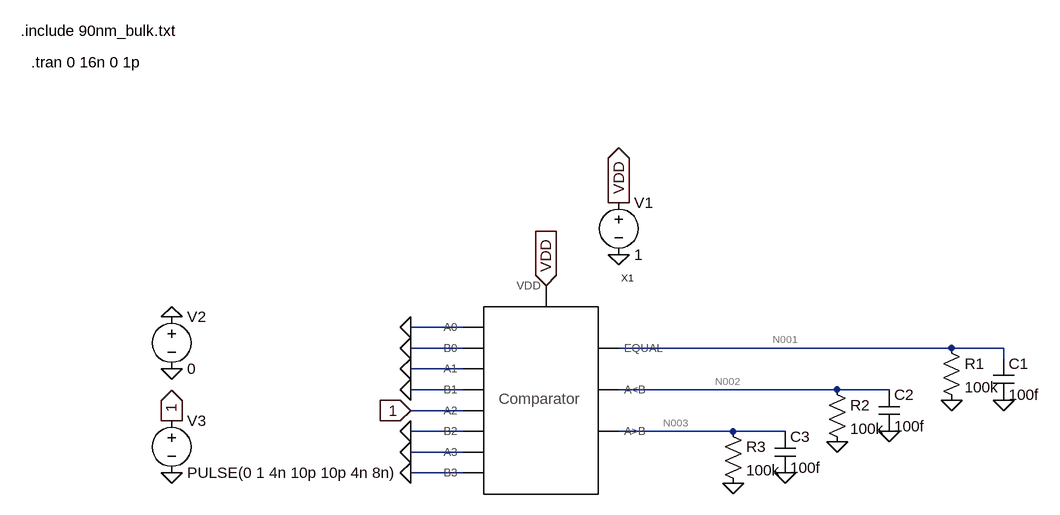
[diagram p0: schematic testComp.asc]
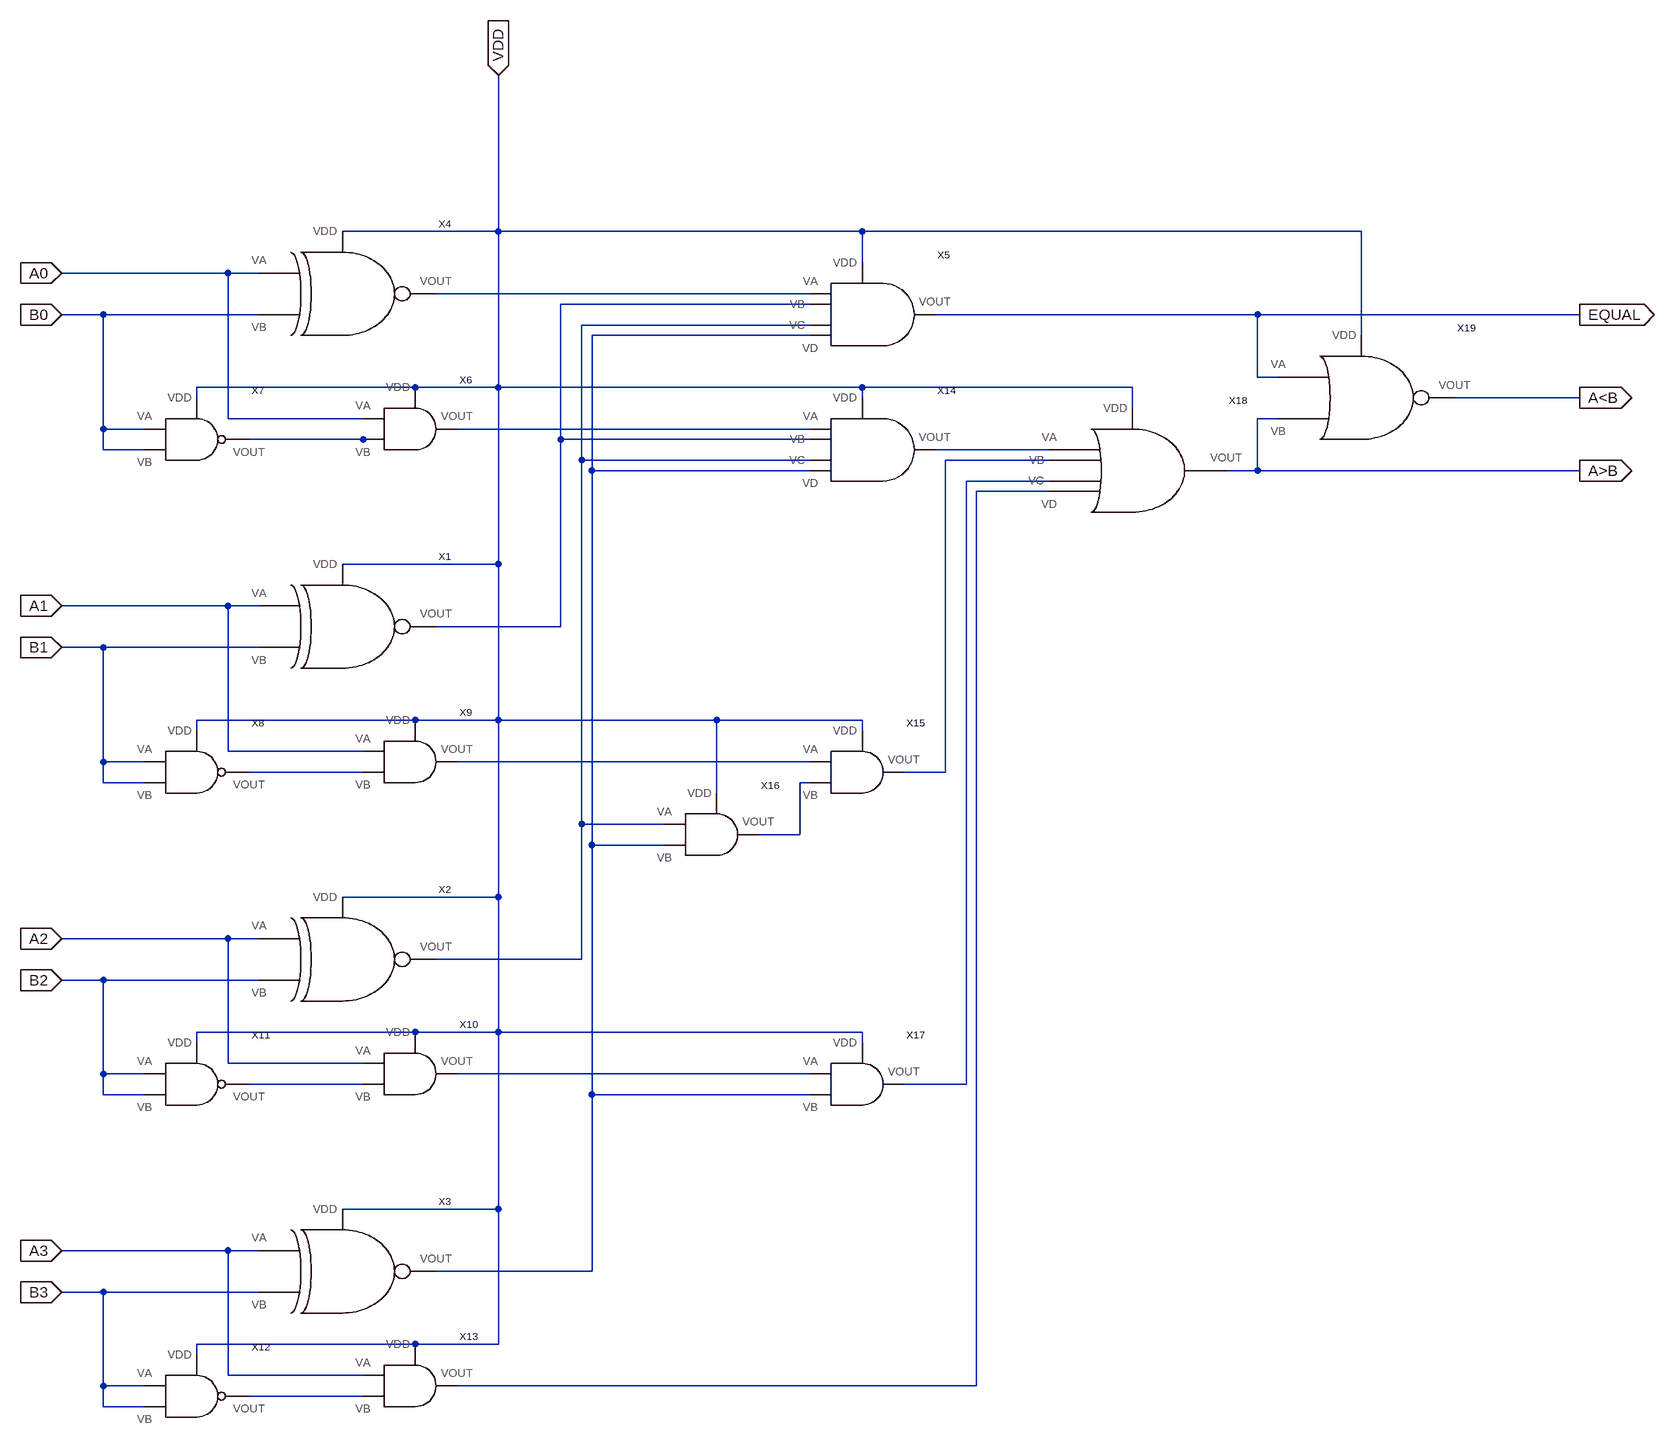
[diagram p1: sub-circuit comparator.asc]
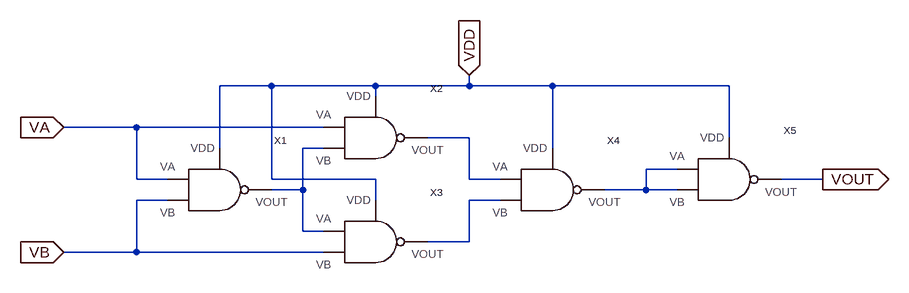
[diagram p2: sub-circuit xnor.asc]
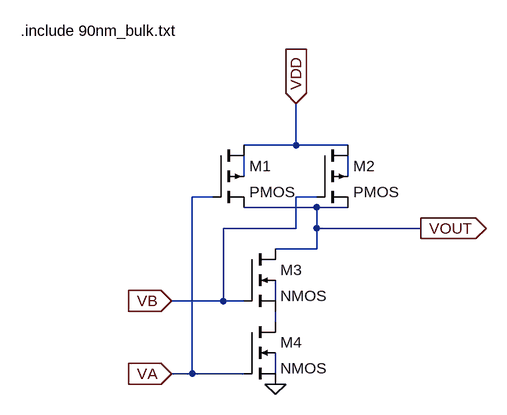
[diagram p3: sub-circuit nand.asc]
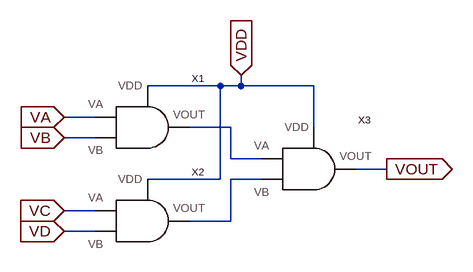
[diagram p4: sub-circuit and4.asc]
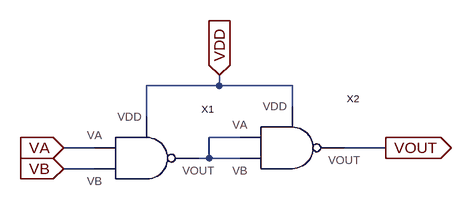
[diagram p5: sub-circuit and.asc]
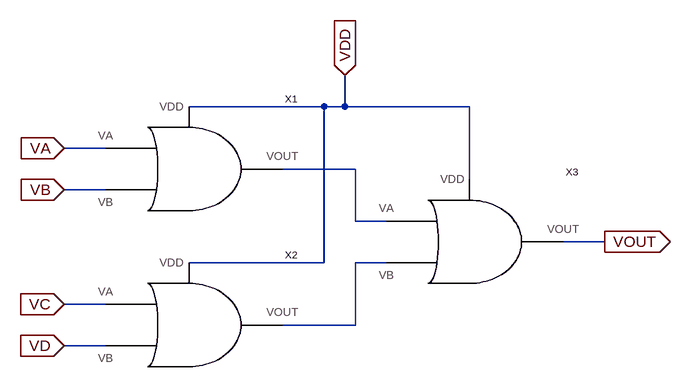
[diagram p6: sub-circuit or4.asc]
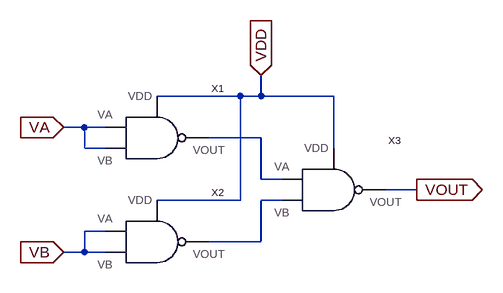
[diagram p7: sub-circuit or.asc]
testComp.asc, the LTspice schematic file:
Version 4
SHEET 1 1360 724
WIRE 112 80 32 80
WIRE 112 112 32 112
WIRE 864 112 352 112
WIRE 944 112 864 112
WIRE 944 128 944 112
WIRE 112 144 32 144
WIRE 112 176 32 176
WIRE 688 176 352 176
WIRE 768 176 688 176
WIRE 112 208 32 208
WIRE 112 240 32 240
WIRE 528 240 352 240
WIRE 608 240 528 240
WIRE 112 272 32 272
WIRE 112 304 32 304
FLAG 32 80 0
IOPIN 32 80 In
FLAG 32 112 0
IOPIN 32 112 In
FLAG 32 144 0
IOPIN 32 144 In
FLAG 32 176 0
IOPIN 32 176 In
FLAG 32 208 1
IOPIN 32 208 In
FLAG 32 240 0
IOPIN 32 240 In
FLAG 32 272 0
IOPIN 32 272 In
FLAG 32 304 0
IOPIN 32 304 In
FLAG 944 192 0
FLAG 768 240 0
FLAG 608 304 0
FLAG 864 192 0
FLAG 688 256 0
FLAG 528 320 0
FLAG 352 -32 0
FLAG 352 -112 VDD
IOPIN 352 -112 Out
FLAG -336 144 0
FLAG -336 64 0
IOPIN -336 64 Out
FLAG -336 304 0
FLAG -336 224 1
IOPIN -336 224 Out
FLAG 240 16 VDD
IOPIN 240 16 In
SYMBOL comparator 160 144 R0
SYMATTR InstName X1
SYMBOL cap 928 128 R0
SYMATTR InstName C1
SYMATTR Value 100f
SYMBOL cap 752 176 R0
SYMATTR InstName C2
SYMATTR Value 100f
SYMBOL cap 592 240 R0
SYMATTR InstName C3
SYMATTR Value 100f
SYMBOL res 848 96 R0
SYMATTR InstName R1
SYMATTR Value 100k
SYMBOL res 672 160 R0
SYMATTR InstName R2
SYMATTR Value 100k
SYMBOL res 512 224 R0
SYMATTR InstName R3
SYMATTR Value 100k
SYMBOL voltage 352 -128 R0
WINDOW 123 0 0 Left 0
WINDOW 39 0 0 Left 0
SYMATTR InstName V1
SYMATTR Value 1
SYMBOL voltage -336 48 R0
WINDOW 123 0 0 Left 0
WINDOW 39 0 0 Left 0
SYMATTR InstName V2
SYMATTR Value 0
SYMBOL voltage -336 208 R0
WINDOW 123 0 0 Left 0
WINDOW 39 0 0 Left 0
SYMATTR InstName V3
SYMATTR Value PULSE(0 1 4n 10p 10p 4n 8n)
TEXT -568 -376 Left 2 !.include 90nm_bulk.txt
TEXT -552 -328 Left 2 !.tran 0 16n 0 1p

comparator.asc, the sub-circuit schematic file:
Version 4
SHEET 1 2092 1544
WIRE 288 -304 288 -544
WIRE 288 -304 48 -304
WIRE 848 -304 288 -304
WIRE 1616 -304 848 -304
WIRE 848 -256 848 -304
WIRE -128 -240 -384 -240
WIRE -80 -240 -128 -240
WIRE 768 -208 192 -208
WIRE 768 -192 384 -192
WIRE -320 -176 -384 -176
WIRE -80 -176 -320 -176
WIRE 1456 -176 960 -176
WIRE 1952 -176 1456 -176
WIRE 768 -160 416 -160
WIRE 768 -144 432 -144
WIRE 1616 -144 1616 -304
WIRE 1456 -80 1456 -176
WIRE 1488 -80 1456 -80
WIRE 160 -64 -176 -64
WIRE 288 -64 288 -304
WIRE 288 -64 160 -64
WIRE 848 -64 288 -64
WIRE 1264 -64 848 -64
WIRE -176 -48 -176 -64
WIRE 848 -48 848 -64
WIRE 1952 -48 1760 -48
WIRE 1264 -32 1264 -64
WIRE -128 -16 -128 -240
WIRE 80 -16 -128 -16
WIRE 1488 -16 1456 -16
WIRE -320 0 -320 -176
WIRE -256 0 -320 0
WIRE 768 0 224 0
WIRE 80 16 -96 16
WIRE 96 16 80 16
WIRE 384 16 384 -192
WIRE 768 16 384 16
WIRE -320 32 -320 0
WIRE -256 32 -320 32
WIRE 1136 32 960 32
WIRE 416 48 416 -160
WIRE 768 48 416 48
WIRE 1136 48 976 48
WIRE 432 64 432 -144
WIRE 768 64 432 64
WIRE 1456 64 1456 -16
WIRE 1456 64 1408 64
WIRE 1952 64 1456 64
WIRE 1136 80 1008 80
WIRE 1136 96 1024 96
WIRE 288 208 288 -64
WIRE 288 208 48 208
WIRE -128 272 -384 272
WIRE -80 272 -128 272
WIRE 384 304 384 16
WIRE 384 304 192 304
WIRE -320 336 -384 336
WIRE -80 336 -320 336
WIRE 160 448 -176 448
WIRE 288 448 288 208
WIRE 288 448 160 448
WIRE 624 448 288 448
WIRE 848 448 624 448
WIRE -176 464 -176 448
WIRE 848 464 848 448
WIRE -128 496 -128 272
WIRE 80 496 -128 496
WIRE -320 512 -320 336
WIRE -256 512 -320 512
WIRE 768 512 224 512
WIRE 80 528 -96 528
WIRE 976 528 976 48
WIRE 976 528 912 528
WIRE -320 544 -320 512
WIRE -256 544 -320 544
WIRE 768 544 752 544
WIRE 624 560 624 448
WIRE 416 608 416 48
WIRE 544 608 416 608
WIRE 752 624 752 544
WIRE 752 624 688 624
WIRE 432 640 432 64
WIRE 544 640 432 640
WIRE 288 720 288 448
WIRE 288 720 48 720
WIRE -128 784 -384 784
WIRE -80 784 -128 784
WIRE 416 816 416 608
WIRE 416 816 192 816
WIRE -320 848 -384 848
WIRE -80 848 -320 848
WIRE 160 928 -176 928
WIRE 288 928 288 720
WIRE 288 928 160 928
WIRE 848 928 288 928
WIRE -176 944 -176 928
WIRE 848 944 848 928
WIRE -128 976 -128 784
WIRE 80 976 -128 976
WIRE -320 992 -320 848
WIRE -256 992 -320 992
WIRE 768 992 224 992
WIRE 80 1008 -96 1008
WIRE 1008 1008 1008 80
WIRE 1008 1008 912 1008
WIRE -320 1024 -320 992
WIRE -256 1024 -320 1024
WIRE 432 1024 432 640
WIRE 768 1024 432 1024
WIRE 288 1200 288 928
WIRE 288 1200 48 1200
WIRE -128 1264 -384 1264
WIRE -80 1264 -128 1264
WIRE 432 1296 432 1024
WIRE 432 1296 192 1296
WIRE -320 1328 -384 1328
WIRE -80 1328 -320 1328
WIRE 160 1408 -176 1408
WIRE 288 1408 288 1200
WIRE 288 1408 160 1408
WIRE -176 1424 -176 1408
WIRE -128 1456 -128 1264
WIRE 80 1456 -128 1456
WIRE -320 1472 -320 1328
WIRE -256 1472 -320 1472
WIRE 1024 1472 1024 96
WIRE 1024 1472 224 1472
WIRE 80 1488 -96 1488
WIRE -320 1504 -320 1472
WIRE -256 1504 -320 1504
FLAG -384 -240 A0
IOPIN -384 -240 In
FLAG -384 -176 B0
IOPIN -384 -176 In
FLAG -384 336 B1
IOPIN -384 336 In
FLAG -384 784 A2
IOPIN -384 784 In
FLAG -384 848 B2
IOPIN -384 848 In
FLAG -384 1264 A3
IOPIN -384 1264 In
FLAG -384 1328 B3
IOPIN -384 1328 In
FLAG -384 272 A1
IOPIN -384 272 In
FLAG 288 -544 VDD
IOPIN 288 -544 In
FLAG 1952 -176 EQUAL
IOPIN 1952 -176 Out
FLAG 1952 64 A>B
IOPIN 1952 64 Out
FLAG 1952 -48 A<B
IOPIN 1952 -48 Out
SYMBOL xnor 32 304 R0
SYMATTR InstName X1
SYMBOL xnor 32 816 R0
SYMATTR InstName X2
SYMBOL xnor 32 1296 R0
SYMATTR InstName X3
SYMBOL xnor 32 -208 R0
SYMATTR InstName X4
SYMBOL and4 816 -176 R0
SYMATTR InstName X5
SYMBOL and 128 0 R0
SYMATTR InstName X6
SYMBOL nand -192 0 R0
SYMATTR InstName X7
SYMBOL nand -192 512 R0
SYMATTR InstName X8
SYMBOL and 128 512 R0
SYMATTR InstName X9
SYMBOL and 128 992 R0
SYMATTR InstName X10
SYMBOL nand -192 992 R0
SYMATTR InstName X11
SYMBOL nand -192 1472 R0
SYMATTR InstName X12
SYMBOL and 128 1472 R0
SYMATTR InstName X13
SYMBOL and4 816 32 R0
SYMATTR InstName X14
SYMBOL and 816 528 R0
SYMATTR InstName X15
SYMBOL and 592 624 R0
SYMATTR InstName X16
SYMBOL and 816 1008 R0
SYMATTR InstName X17
SYMBOL or4 1248 64 R0
SYMATTR InstName X18
SYMBOL nor 1600 -48 R0
SYMATTR InstName X19

xnor.asc, the sub-circuit schematic file:
Version 4
SHEET 1 1196 680
WIRE 224 0 144 0
WIRE 384 0 224 0
WIRE 528 0 528 -16
WIRE 528 0 384 0
WIRE 656 0 528 0
WIRE 928 0 656 0
WIRE 384 16 384 0
WIRE 16 64 -96 64
WIRE 304 64 16 64
WIRE 528 80 464 80
WIRE 928 80 928 0
WIRE 144 96 144 0
WIRE 304 96 272 96
WIRE 656 96 656 0
WIRE 848 128 800 128
WIRE 16 144 16 64
WIRE 64 144 16 144
WIRE 224 144 224 0
WIRE 384 144 224 144
WIRE 528 144 528 80
WIRE 576 144 528 144
WIRE 1072 144 1008 144
WIRE 272 160 272 96
WIRE 272 160 224 160
WIRE 800 160 800 128
WIRE 800 160 736 160
WIRE 848 160 800 160
WIRE 64 176 16 176
WIRE 384 176 384 144
WIRE 576 176 528 176
WIRE 272 224 272 160
WIRE 304 224 272 224
WIRE 528 240 528 176
WIRE 528 240 464 240
WIRE 16 256 16 176
WIRE 16 256 -96 256
WIRE 304 256 16 256
FLAG 528 -16 VDD
IOPIN 528 -16 In
FLAG -96 64 VA
IOPIN -96 64 In
FLAG -96 256 VB
IOPIN -96 256 In
FLAG 1072 144 VOUT
IOPIN 1072 144 Out
SYMBOL nand 128 144 R0
SYMATTR InstName X1
SYMBOL nand 368 64 R0
SYMATTR InstName X2
SYMBOL nand 368 224 R0
SYMATTR InstName X3
SYMBOL nand 640 144 R0
SYMATTR InstName X4
SYMBOL nand 912 128 R0
SYMATTR InstName X5

nand.asc, the sub-circuit schematic file:
Version 4
SHEET 1 880 696
WIRE 496 272 496 208
WIRE 496 272 416 272
WIRE 576 272 496 272
WIRE 416 320 416 288
WIRE 576 320 576 288
WIRE 368 352 336 352
WIRE 528 352 496 352
WIRE 528 368 416 368
WIRE 576 368 528 368
WIRE 496 400 496 352
WIRE 496 400 384 400
WIRE 528 400 528 368
WIRE 688 400 528 400
WIRE 528 432 528 400
WIRE 528 432 464 432
WIRE 384 512 384 400
WIRE 384 512 304 512
WIRE 416 512 384 512
WIRE 464 512 464 480
WIRE 464 544 464 528
WIRE 336 624 336 352
WIRE 336 624 304 624
WIRE 416 624 336 624
WIRE 464 624 464 592
FLAG 304 624 VA
IOPIN 304 624 In
FLAG 304 512 VB
IOPIN 304 512 In
FLAG 496 208 VDD
IOPIN 496 208 In
FLAG 688 400 VOUT
IOPIN 688 400 Out
FLAG 464 640 0
SYMBOL nmos4 416 432 R0
SYMATTR InstName M3
SYMATTR Value2 l=90n w=200n
SYMBOL nmos4 416 544 R0
SYMATTR InstName M4
SYMATTR Value2 l=90n w=200n
SYMBOL pmos4 368 272 R0
SYMATTR InstName M1
SYMATTR Value2 l=90n w=400n
SYMBOL pmos4 528 272 R0
SYMATTR InstName M2
SYMATTR Value2 l=90n w=400n
TEXT 72 96 Left 2 !.include 90nm_bulk.txt

and4.asc, the sub-circuit schematic file:
Version 4
SHEET 1 880 680
WIRE 240 48 128 48
WIRE 272 48 272 32
WIRE 272 48 240 48
WIRE 384 48 272 48
WIRE 48 96 0 96
WIRE 256 112 192 112
WIRE 384 112 384 48
WIRE 48 128 0 128
WIRE 256 160 256 112
WIRE 304 160 256 160
WIRE 496 176 448 176
WIRE 240 192 240 48
WIRE 240 192 128 192
WIRE 304 192 256 192
WIRE 48 240 0 240
WIRE 256 256 256 192
WIRE 256 256 192 256
WIRE 48 272 0 272
FLAG 272 32 VDD
IOPIN 272 32 In
FLAG 496 176 VOUT
IOPIN 496 176 Out
FLAG 0 96 VA
IOPIN 0 96 In
FLAG 0 128 VB
IOPIN 0 128 In
FLAG 0 240 VC
IOPIN 0 240 In
FLAG 0 272 VD
IOPIN 0 272 In
SYMBOL and 96 112 R0
SYMATTR InstName X1
SYMBOL and 96 256 R0
SYMATTR InstName X2
SYMBOL and 352 176 R0
SYMATTR InstName X3

and.asc, the sub-circuit schematic file:
Version 4
SHEET 1 880 680
WIRE 240 32 240 16
WIRE 240 32 128 32
WIRE 352 32 240 32
WIRE 352 64 352 32
WIRE 128 80 128 32
WIRE 272 112 224 112
WIRE 48 128 0 128
WIRE 496 128 432 128
WIRE 224 144 224 112
WIRE 224 144 208 144
WIRE 272 144 224 144
WIRE 48 160 0 160
FLAG 0 160 VB
IOPIN 0 160 In
FLAG 0 128 VA
IOPIN 0 128 In
FLAG 240 16 VDD
IOPIN 240 16 In
FLAG 496 128 VOUT
IOPIN 496 128 Out
SYMBOL nand 336 112 R0
SYMATTR InstName X2
SYMBOL nand 112 128 R0
SYMATTR InstName X1

or4.asc, the sub-circuit schematic file:
Version 4
SHEET 1 1196 680
WIRE 320 -112 112 -112
WIRE 352 -112 352 -160
WIRE 352 -112 320 -112
WIRE 544 -112 352 -112
WIRE -16 -48 -80 -48
WIRE 368 -16 256 -16
WIRE 544 0 544 -112
WIRE -16 16 -80 16
WIRE 368 64 368 -16
WIRE 416 64 368 64
WIRE 752 96 688 96
WIRE 320 128 320 -112
WIRE 320 128 112 128
WIRE 416 128 368 128
WIRE -16 192 -80 192
WIRE 368 224 368 128
WIRE 368 224 256 224
WIRE -16 256 -80 256
FLAG 352 -160 VDD
IOPIN 352 -160 In
FLAG -80 -48 VA
IOPIN -80 -48 In
FLAG -80 16 VB
IOPIN -80 16 In
FLAG -80 192 VC
IOPIN -80 192 In
FLAG -80 256 VD
IOPIN -80 256 In
FLAG 752 96 VOUT
IOPIN 752 96 Out
SYMBOL or 96 -16 R0
SYMATTR InstName X1
SYMBOL or 96 224 R0
SYMATTR InstName X2
SYMBOL or 528 96 R0
SYMATTR InstName X3

or.asc, the sub-circuit schematic file:
Version 4
SHEET 1 880 680
WIRE 240 48 112 48
WIRE 272 48 272 16
WIRE 272 48 240 48
WIRE 384 48 272 48
WIRE 0 96 -32 96
WIRE 32 96 0 96
WIRE 272 112 192 112
WIRE 0 128 0 96
WIRE 32 128 0 128
WIRE 384 128 384 48
WIRE 272 176 272 112
WIRE 304 176 272 176
WIRE 512 192 464 192
WIRE 240 208 240 48
WIRE 240 208 112 208
WIRE 304 208 272 208
WIRE 32 256 0 256
WIRE 272 272 272 208
WIRE 272 272 192 272
WIRE 0 288 0 256
WIRE 0 288 -32 288
WIRE 32 288 0 288
FLAG 272 16 VDD
IOPIN 272 16 In
FLAG -32 96 VA
IOPIN -32 96 In
FLAG -32 288 VB
IOPIN -32 288 In
FLAG 512 192 VOUT
IOPIN 512 192 Out
SYMBOL nand 96 96 R0
SYMATTR InstName X1
SYMBOL nand 96 256 R0
SYMATTR InstName X2
SYMBOL nand 368 176 R0
SYMATTR InstName X3

nor.asc, the sub-circuit schematic file:
Version 4
SHEET 1 880 680
WIRE 240 48 112 48
WIRE 272 48 272 16
WIRE 272 48 240 48
WIRE 384 48 272 48
WIRE 608 48 384 48
WIRE 0 96 -32 96
WIRE 32 96 0 96
WIRE 272 112 192 112
WIRE 608 112 608 48
WIRE 0 128 0 96
WIRE 32 128 0 128
WIRE 384 128 384 48
WIRE 528 160 480 160
WIRE 272 176 272 112
WIRE 304 176 272 176
WIRE 736 176 688 176
WIRE 480 192 480 160
WIRE 480 192 464 192
WIRE 528 192 480 192
WIRE 240 208 240 48
WIRE 240 208 112 208
WIRE 304 208 272 208
WIRE 32 256 0 256
WIRE 272 272 272 208
WIRE 272 272 192 272
WIRE 0 288 0 256
WIRE 0 288 -32 288
WIRE 32 288 0 288
FLAG 272 16 VDD
IOPIN 272 16 In
FLAG -32 96 VA
IOPIN -32 96 In
FLAG -32 288 VB
IOPIN -32 288 In
FLAG 736 176 VOUT
IOPIN 736 176 Out
SYMBOL nand 96 96 R0
SYMATTR InstName X1
SYMBOL nand 96 256 R0
SYMATTR InstName X2
SYMBOL nand 368 176 R0
SYMATTR InstName X3
SYMBOL nand 592 160 R0
SYMATTR InstName X4

The netlist it stands for:
* testComp.asc
XX1 0 0 0 0 1 0 0 0 VDD N001 N002 N003 comparator
C1 N001 0 100f
C2 N002 0 100f
C3 N003 0 100f
R1 N001 0 100k
R2 N002 0 100k
R3 N003 0 100k
V1 VDD 0 1
V2 0 0 0
V3 1 0 PULSE(0 1 4n 10p 10p 4n 8n)

* block symbol definitions
.subckt comparator A0 B0 A1 B1 A2 B2 A3 B3 VDD EQUAL A<B A>B
XX1 A1 B1 VDD N002 xnor
XX2 A2 B2 VDD N003 xnor
XX3 A3 B3 VDD N004 xnor
XX4 A0 B0 VDD N001 xnor
XX5 N001 N002 N003 N004 VDD EQUAL and4
XX6 A0 N006 N005 VDD and
XX7 B0 B0 VDD N006 nand
XX8 B1 B1 VDD N012 nand
XX9 A1 N012 N011 VDD and
XX10 A2 N015 N014 VDD and
XX11 B2 B2 VDD N015 nand
XX12 B3 B3 VDD N016 nand
XX13 A3 N016 N010 VDD and
XX14 N005 N002 N003 N004 VDD N007 and4
XX15 N011 N013 N008 VDD and
XX16 N003 N004 N013 VDD and
XX17 N014 N004 N009 VDD and
XX18 N007 N010 VDD A>B N008 N009 or4
XX19 EQUAL A>B VDD A<B nor
.ends comparator

.subckt xnor VA VB VDD VOUT
XX1 VA VB VDD N002 nand
XX2 VA N002 VDD N001 nand
XX3 N002 VB VDD N004 nand
XX4 N001 N004 VDD N003 nand
XX5 N003 N003 VDD VOUT nand
.ends xnor

.subckt nand VA VB VDD VOUT
M3 VOUT VB N004 N003 NMOS l=90n w=200n
M4 N004 VA 0 N005 NMOS l=90n w=200n
M1 VDD VA VOUT N001 PMOS l=90n w=400n
M2 VDD VB VOUT N002 PMOS l=90n w=400n
.include 90nm_bulk.txt
.ends nand

.subckt and4 VA VB VC VD VDD VOUT
XX1 VA VB N001 VDD and
XX2 VC VD N002 VDD and
XX3 N001 N002 VOUT VDD and
.ends and4

.subckt and VA VB VOUT VDD
XX2 N001 N001 VDD VOUT nand
XX1 VA VB VDD N001 nand
.ends and

.subckt or4 VA VD VDD VOUT VB VC
XX1 VA VB VDD N001 or
XX2 VC VD VDD N002 or
XX3 N001 N002 VDD VOUT or
.ends or4

.subckt or VA VB VDD VOUT
XX1 VA VA VDD N001 nand
XX2 VB VB VDD N002 nand
XX3 N001 N002 VDD VOUT nand
.ends or

.subckt nor VA VB VDD VOUT
XX1 VA VA VDD N001 nand
XX2 VB VB VDD N003 nand
XX3 N001 N003 VDD N002 nand
XX4 N002 N002 VDD VOUT nand
.ends nor

.model NMOS NMOS
.model PMOS PMOS
.lib standard.mos
.include 90nm_bulk.txt
.tran 0 16n 0 1p
.backanno
.end

* Results of the author's LTspice run, read from the files saved beside the schematic
* Operating Point, zero values left out:
*   V(vdd) = 1 V
*   V(n001) = 986.8 mV
*   V(n003) = 96.14 µV
*   V(n002) = 95.86 µV
*   I(R1) = 9.868 µA
*   I(R2) = 958.6 pA
*   I(R3) = 961.4 pA
*   I(V1) = -10.98 µA
*   I(V3) = 90.81 pA
*   Ix(x1:A0) = -90.81 pA
*   Ix(x1:B0) = -395.7 pA
*   Ix(x1:A1) = -90.81 pA
*   Ix(x1:B1) = -395.7 pA
*   Ix(x1:A2) = -90.81 pA
*   Ix(x1:B2) = -395.7 pA
*   Ix(x1:A3) = -90.81 pA
*   Ix(x1:B3) = -395.7 pA
*   Ix(x1:VDD) = 10.98 µA
*   Ix(x1:EQUAL) = -9.868 µA
*   Ix(x1:A<B) = -958.6 pA
*   Ix(x1:A>B) = -961.4 pA
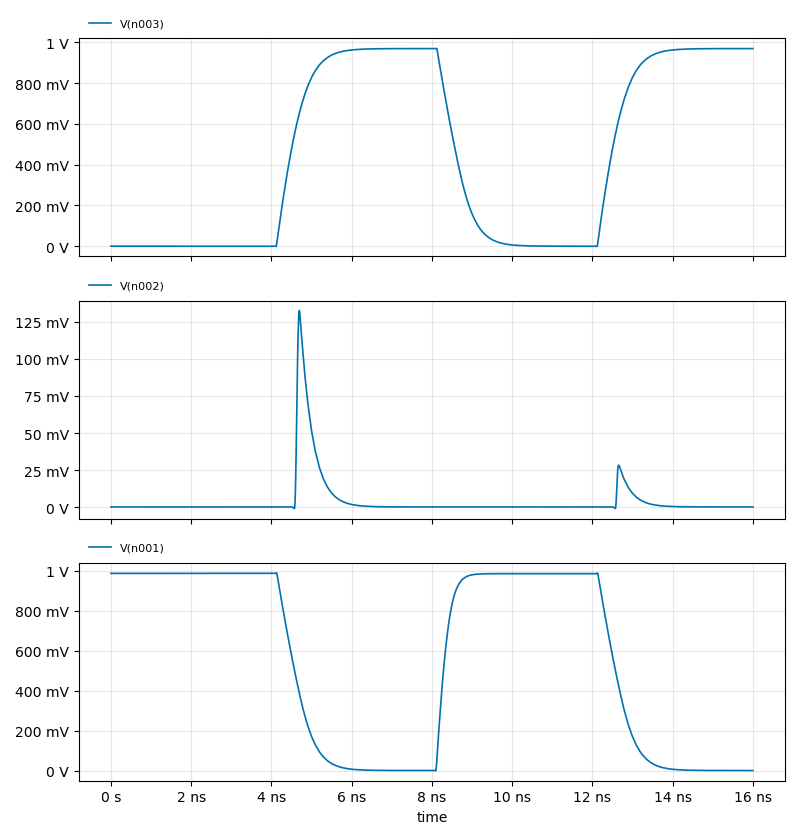
[diagram p8: Transient Analysis of testComp.asc, plotted from the saved traces]
* Transient Analysis, 1 run:
*   V(n003): min -1.119 mV, max 970.4 mV, average 450.5 mV, rms 632.1 mV, last 969.2 mV
*   V(n002): min -1.03 mV, max 132.6 mV, average 3.863 mV, rms 15.78 mV, last 96.07 µV
*   V(n001): min -1.074 mV, max 990.2 mV, average 553.9 mV, rms 717.2 mV, last 334.5 µV